# EAGLE schematic Q_Control (EAGLE 6.3)
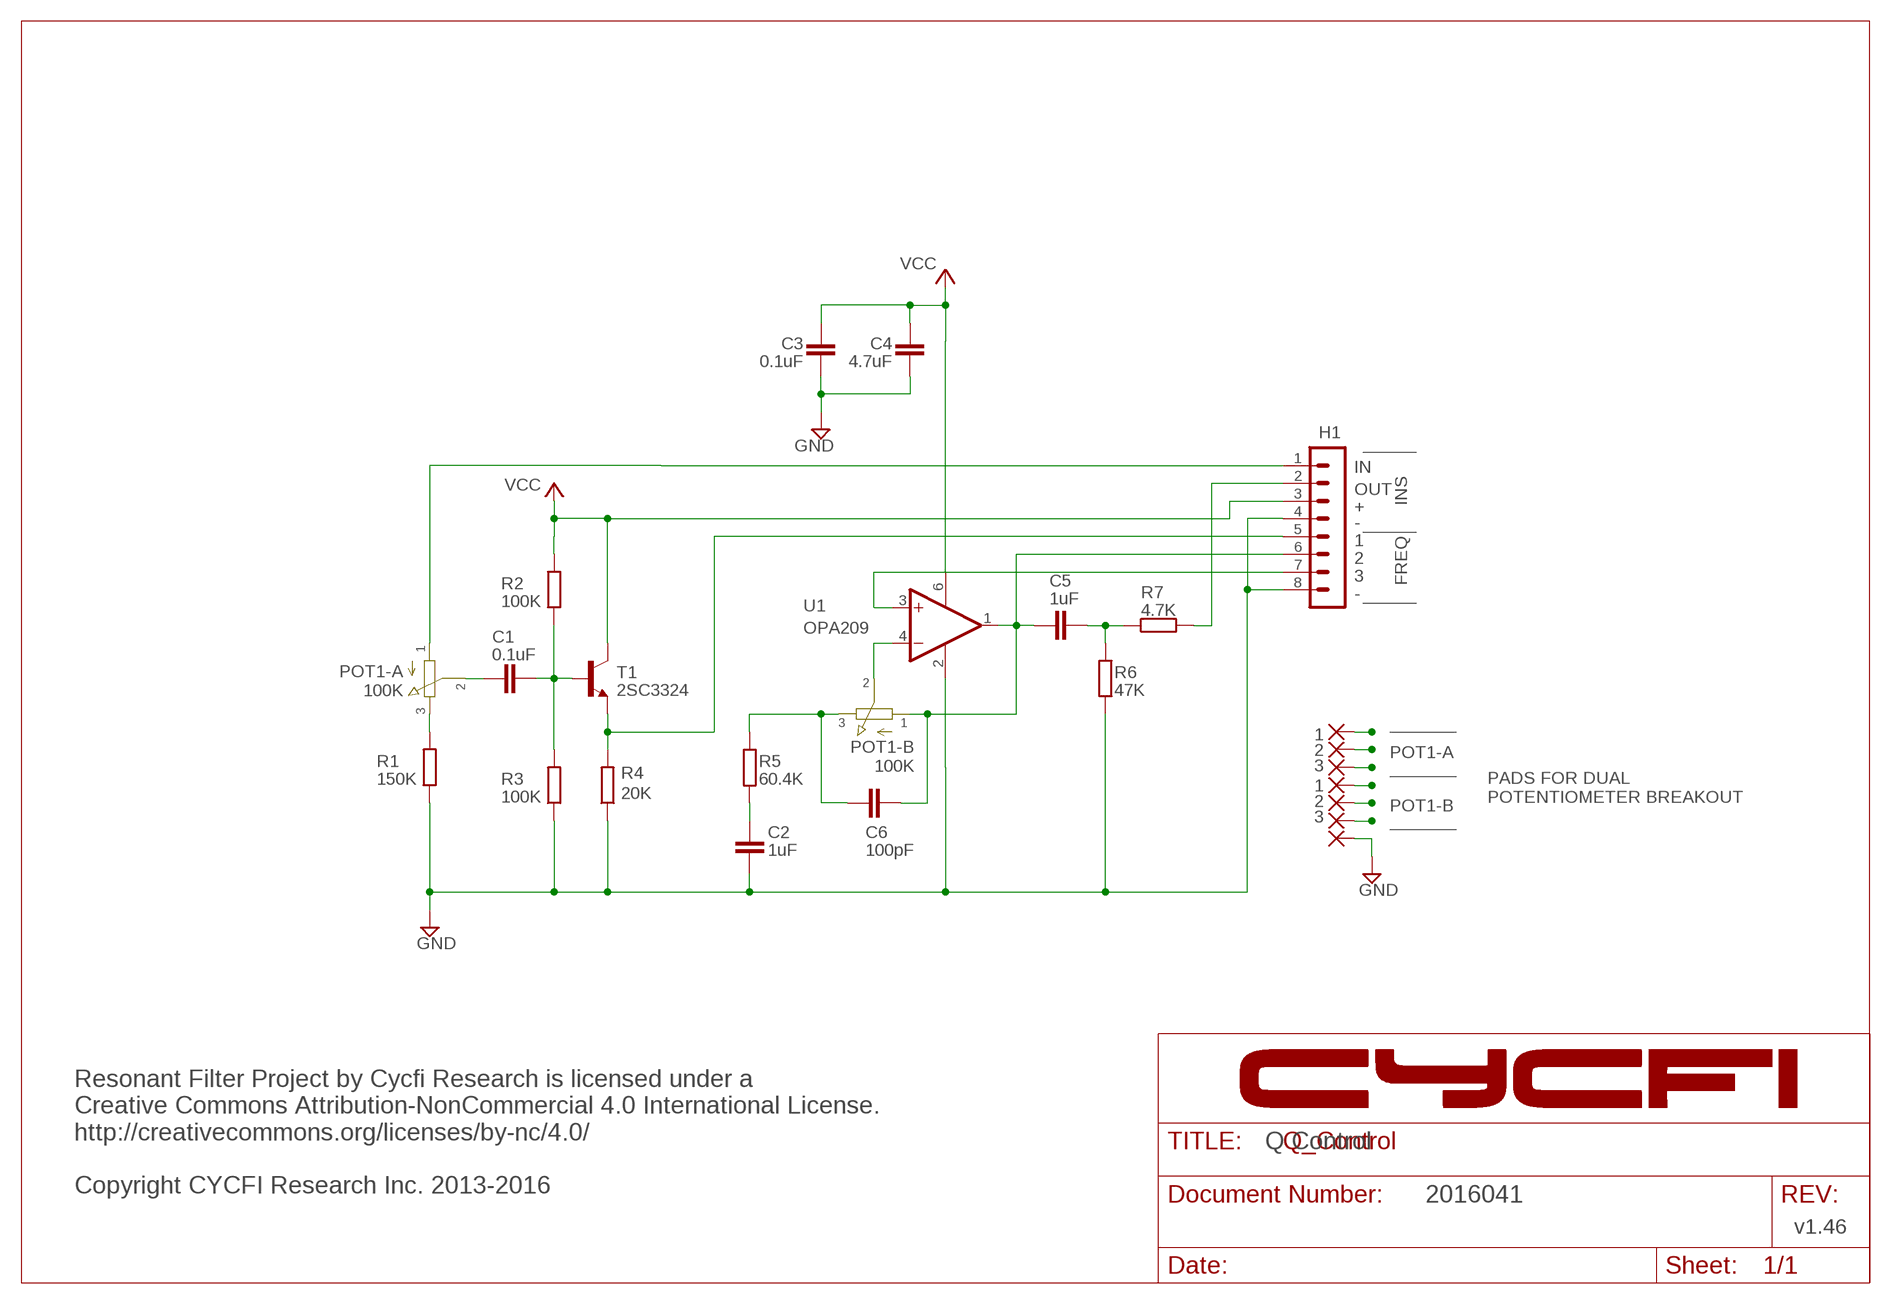
[diagram p0: schematic, sheet 1]

## Parts
C1  0.1uF  C-EUC0603  [C0603]
C2  1uF  C-EUC0805  [C0805]
C3  0.1uF  C-EUC0603  [C0603]
C4  4.7uF  C-EUC0603  [C0603]
C5  1uF  C-EUC0805  [C0805]
C6  100pF  C-EUC0805  [C0805]
H1  MA08-1  [MA08-1]
PAD1  SMD2  [SMD1,27-2,54]
PAD2  SMD2  [SMD1,27-2,54]
PAD3  SMD2  [SMD1,27-2,54]
PAD4  SMD2  [SMD1,27-2,54]
PAD5  SMD2  [SMD1,27-2,54]
PAD6  SMD2  [SMD1,27-2,54]
PAD7  SMD2  [SMD1,27-2,54]
R1  150K  R-EU_R0402  [R0402]
R2  100K  R-EU_R0402  [R0402]
R3  100K  R-EU_R0402  [R0402]
R4  20K  R-EU_R0402  [R0402]
R5  60.4K  R-EU_R0402  [R0402]
R6  47K  R-EU_R0402  [R0402]
R7  4.7K  R-EU_R0402  [R0402]
T1  2SC3324  BC846  [SOT23]
U1  OPA209  OPA836  [SOT23-6]

## Nets
1: H1.5 R4.2 T1.2(E)
3: H1.7 U1.3(+IN)
ASDADS: C5.1 R6.2 R7.1
BYP: H1.1 PAD1.1(P)
EQ: H1.2 R7.2
GND: C2.1 C3.1 C4.1 H1.4 H1.8 PAD7.1(P) R1.1 R3.1 R4.1 R6.1 U1.2(V-)
INPUT: C1.1 PAD2.1(P)
N$4: C1.2 R2.1 R3.2 T1.1(B)
N$8: C2.2 R5.2
PA-3: PAD3.1(P) R1.2
PTB-1: C5.2 C6.2 H1.6 PAD5.1(P) U1.1(OUT)
PTB-2: PAD6.1(P) U1.4(-IN)
PTB-3: C6.1 PAD4.1(P) R5.1
VIN: C3.2 C4.2 H1.3 R2.2 T1.3(C) U1.6(V+) ; supply symbol labelled VCC

## Notes on the sheet
- IN
- OUT
- + | INS
- -
- 1
- 2
- 3
- - | FREQ
- 1
- POT1-A
  100K
- 2
- 2
- 3
- 3 | 1
- 1
- 2 | POT1-A
- POT1-B
  100K
- 3
- 1
- PADS FOR DUAL 
  POTENTIOMETER BREAKOUT
- 2 | POT1-B
- 3
- Q Control
- Resonant Filter Project by Cycfi Research is licensed under a 
  Creative Commons Attribution-NonCommercial 4.0 International License. 
  http://creativecommons.org/licenses/by-nc/4.0/
  
  Copyright CYCFI Research Inc. 2013-2016
- 2016041
- v1.46

## Library data of the parts
C1-C6 = resistor:C-EU: CAPACITOR, European symbol
H1 = con-lstb:MA08-1: PIN HEADER; OC_FARNELL: unknown; OC_NEWARK: unknown
PAD1-PAD7 = wirepad:SMD2: SMD PAD
R1-R7 = resistor:R-EU_: RESISTOR, European symbol
T1 = transistor:BC846: NPN TRANSISTOR
U1 = CYCFI:OPA836: OPA836 Single amplifier